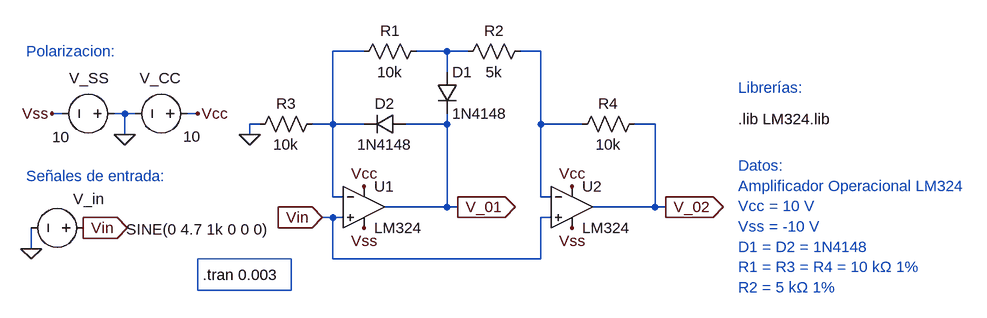
[diagram p0: schematic Lab_1_Circ_3_Vin(ca)=4.7.asc]
Lab_1_Circ_3_Vin(ca)=4.7.asc, the LTspice schematic file:
Version 4
SHEET 1 1560 680
WIRE 224 -320 176 -320
WIRE 352 -320 304 -320
WIRE 384 -320 352 -320
WIRE 496 -320 464 -320
WIRE 352 -288 352 -320
WIRE -240 -224 -256 -224
WIRE -144 -224 -160 -224
WIRE -128 -224 -144 -224
WIRE -32 -224 -48 -224
WIRE 64 -208 48 -208
WIRE 176 -208 176 -320
WIRE 176 -208 144 -208
WIRE 224 -208 176 -208
WIRE 352 -208 352 -224
WIRE 352 -208 288 -208
WIRE 496 -208 496 -320
WIRE 560 -208 496 -208
WIRE 672 -208 640 -208
WIRE -144 -192 -144 -224
WIRE 48 -192 48 -208
WIRE 176 -96 176 -208
WIRE 192 -96 176 -96
WIRE 496 -96 496 -208
WIRE 512 -96 496 -96
WIRE 352 -80 352 -208
WIRE 352 -80 256 -80
WIRE 368 -80 352 -80
WIRE 672 -80 672 -208
WIRE 672 -80 576 -80
WIRE 688 -80 672 -80
WIRE 176 -64 160 -64
WIRE 192 -64 176 -64
WIRE 512 -64 496 -64
WIRE -288 -16 -288 -48
WIRE 176 0 176 -64
WIRE 496 0 496 -64
WIRE 496 0 176 0
FLAG 48 -192 0
FLAG -32 -224 Vcc
FLAG 224 -112 Vcc
FLAG -256 -224 Vss
FLAG 224 -48 Vss
FLAG -144 -192 0
FLAG -288 -16 0
FLAG 688 -80 V_02
IOPIN 688 -80 Out
FLAG 160 -64 Vin
IOPIN 160 -64 In
FLAG -208 -48 Vin
IOPIN -208 -48 Out
FLAG 368 -80 V_01
IOPIN 368 -80 Out
FLAG 544 -112 Vcc
FLAG 544 -48 Vss
SYMBOL OpAmps\\opamp2 224 -144 R0
SYMATTR InstName U1
SYMATTR Value LM324
SYMBOL res 208 -304 R270
WINDOW 0 32 56 VTop 2
WINDOW 3 0 56 VBottom 2
SYMATTR InstName R1
SYMATTR Value 10k
SYMBOL res 368 -304 R270
WINDOW 0 32 56 VTop 2
WINDOW 3 0 56 VBottom 2
SYMATTR InstName R2
SYMATTR Value 5k
SYMBOL res 160 -224 R90
WINDOW 0 0 56 VBottom 2
WINDOW 3 32 56 VTop 2
SYMATTR InstName R3
SYMATTR Value 10k
SYMBOL res 544 -192 R270
WINDOW 0 32 56 VTop 2
WINDOW 3 0 56 VBottom 2
SYMATTR InstName R4
SYMATTR Value 10k
SYMBOL voltage -192 -48 M270
WINDOW 0 45 31 VLeft 2
WINDOW 3 -2 -50 VLeft 2
WINDOW 123 0 0 Left 0
WINDOW 39 0 0 Left 0
SYMATTR InstName V_in
SYMATTR Value SINE(0 4.7 1k 0 0 0)
SYMBOL voltage -32 -224 R90
WINDOW 0 -55 25 VRight 2
WINDOW 3 35 -5 VRight 2
WINDOW 123 0 0 Left 0
WINDOW 39 0 0 Left 0
SYMATTR InstName V_CC
SYMATTR Value 10
SYMBOL voltage -144 -224 R90
WINDOW 0 -55 25 VRight 2
WINDOW 3 36 85 VRight 2
WINDOW 123 0 0 Left 0
WINDOW 39 0 0 Left 0
SYMATTR InstName V_SS
SYMATTR Value 10
SYMBOL OpAmps\\opamp2 544 -144 R0
SYMATTR InstName U2
SYMATTR Value LM324
SYMBOL diode 336 -288 R0
SYMATTR InstName D1
SYMATTR Value 1N4148
SYMBOL diode 288 -224 R90
WINDOW 0 0 32 VBottom 2
WINDOW 3 32 32 VTop 2
SYMATTR InstName D2
SYMATTR Value 1N4148
TEXT 800 -216 Left 2 !.lib LM324.lib
TEXT 800 -264 Left 2 ;Librerías:
TEXT -296 -320 Left 2 ;Polarizacion:
TEXT -296 -128 Left 2 ;Señales de entrada:
TEXT 800 -144 Left 2 ;Datos:\nAmplificador Operacional LM324\nVcc = 10 V\nVss = -10 V\nD1 = D2 = 1N4148\nR1 = R3 = R4 = 10 kΩ 1%\nR2 = 5 kΩ 1%
TEXT -24 24 Left 2 !.tran 0.003
RECTANGLE Normal 112 48 -32 0

The netlist it stands for:
* Lab_1_Circ_3_Vin(ca)=4.7.asc
XU1 Vin N001 Vcc Vss V_01 LM324  ; pins In+ In- V+ V- OUT
R1 N001 N002 10k
R2 N002 N003 5k
R3 N001 0 10k
R4 N003 V_02 10k
V_in Vin 0 SINE(0 4.7 1k 0 0 0)
V_CC Vcc 0 10
V_SS 0 Vss 10
XU2 Vin N003 Vcc Vss V_02 LM324  ; pins In+ In- V+ V- OUT
D1 N002 V_01 1N4148
D2 V_01 N001 1N4148
.model D D
.lib standard.dio
.lib LM324.lib
* Librerías:
* Polarizacion:
* Señales de entrada:
* Datos:
* Amplificador Operacional LM324
* Vcc = 10 V
* Vss = -10 V
* D1 = D2 = 1N4148
* R1 = R3 = R4 = 10 kΩ 1%
* R2 = 5 kΩ 1%
.tran 0.003
.backanno
.end

* Results of the author's LTspice run, read from the files saved beside the schematic
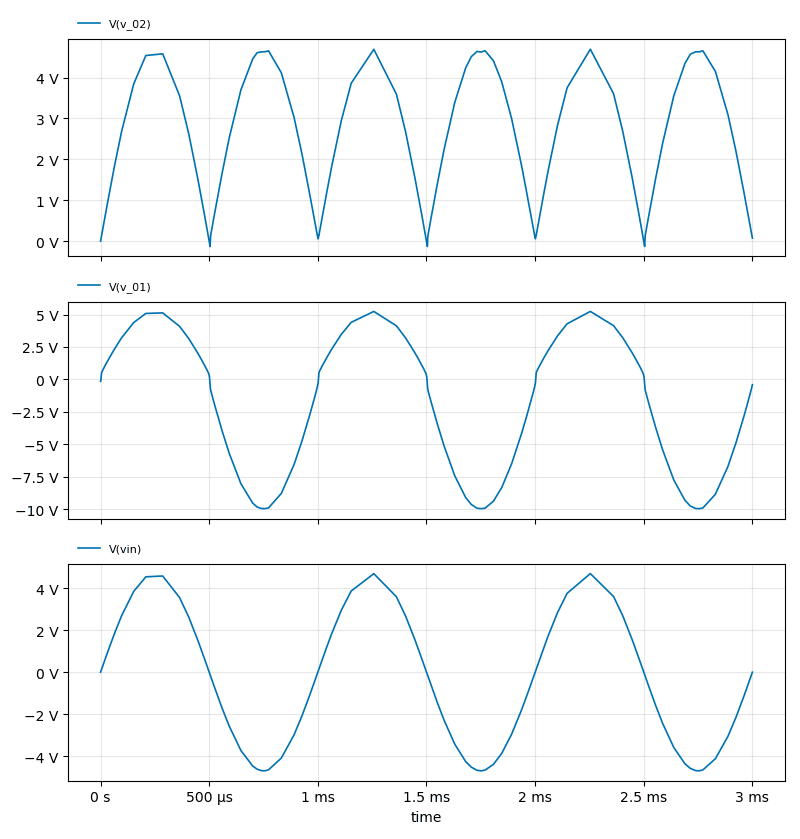
[diagram p1: Transient Analysis of Lab_1_Circ_3_Vin(ca)=4.7.asc, plotted from the saved traces]
* Transient Analysis, 1 run:
*   V(v_02): min -129.9 mV, max 4.692 V, average 2.948 V, rms 3.287 V, last 72.33 mV
*   V(v_01): min -9.961 V, max 5.243 V, average -1.533 V, rms 5.715 V, last -402.1 mV
*   V(vin): min -4.7 V, max 4.693 V, average -22.36 mV, rms 3.291 V, last 0 V